# Altium schematic sheet Power.SchDoc
size A; SheetNumber: 6; SheetTotal: 7
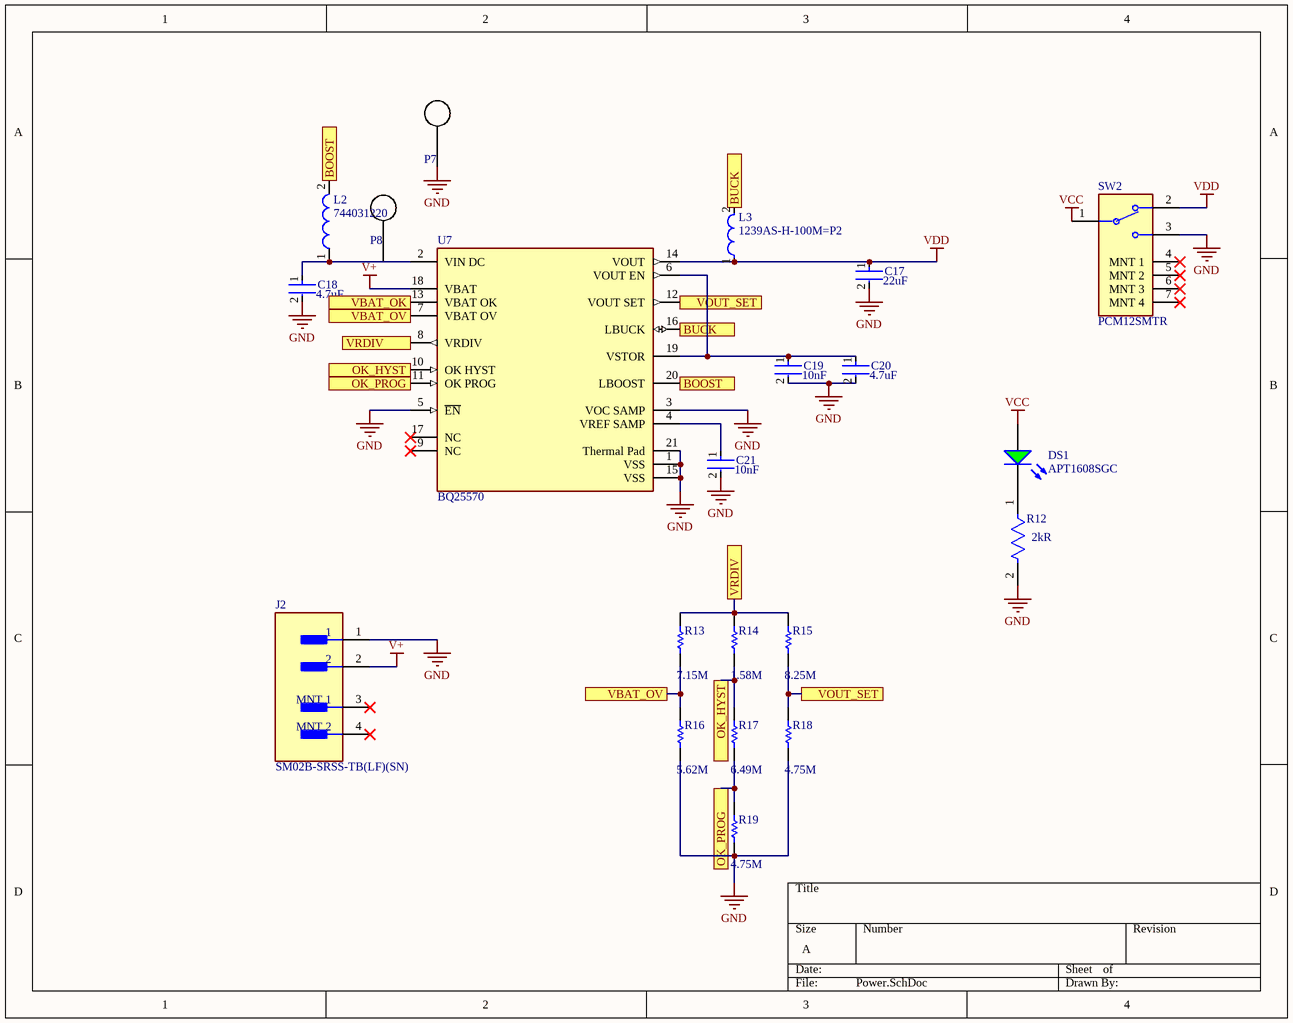
[diagram p0: Power.SchDoc]

## Parts
C17  Capacitance: 22uF  [FP-GRM21B-0_15-MFG]  (hidden comment: GRM21BR60J226ME39L)
C18  Capacitance: 4.7uF  [FP-C0603-CG-MFG]  (hidden comment: C0603C475K9PACTU)
C19  Capacitance: 10nF  [FP-C0805C-DN-MFG]  (hidden comment: C0805C103K2RACTU)
C20  Capacitance: 4.7uF  [FP-C0603-CG-MFG]  (hidden comment: C0603C475K9PACTU)
C21  Capacitance: 10nF  [FP-C0805C-DN-MFG]  (hidden comment: C0805C103K2RACTU)
DS1  APT1608SGC  [KING-APT1608SGC_V]
J2  SM02B-SRSS-TB(LF)(SN)  [FP-SM02B-SRSS-TB_LF_SN-0]
L2  744031220  [WE-TPC-3816-S]
L3  1239AS-H-100M=P2  [FP-DFE252012C-MFG]
P7  BlankPad  [BlankPad]  (value not drawn)
P8  BlankPad  [BlankPad]  (value not drawn)
R12  Resistance: 2kR  [FP-CRCW0805-e3-IPC_B]  (hidden comment: CRCW08052K00FKEA)
R13  Parameter 1: 7.15M  [RESC2013X50X30LL20T20]  (hidden comment: CRCW0805100RFKEA)
R14  Parameter 1: 1.58M  [RESC2013X50X30LL20T20]  (hidden comment: CRCW0805100RFKEA)
R15  Parameter 1: 8.25M  [RESC2013X50X30LL20T20]  (hidden comment: CRCW0805100RFKEA)
R16  Parameter 1: 5.62M  [RESC2013X50X30LL20T20]  (hidden comment: CRCW0805100RFKEA)
R17  Parameter 1: 6.49M  [RESC2013X50X30LL20T20]  (hidden comment: CRCW0805100RFKEA)
R18  Parameter 1: 4.75M  [RESC2013X50X30LL20T20]  (hidden comment: CRCW0805100RFKEA)
R19  Parameter 1: 4.75M  [RESC2013X50X30LL20T20]  (hidden comment: CRCW0805100RFKEA)
SW2  PCM12SMTR  [FP-PCM12SMTR-MFG]
U7  BQ25570  [FP-RGR0020A-MFG]

## Ports
BOOST, BUCK, OK_HYST, OK_PROG, VBAT_OK, VBAT_OV, VOUT_SET, VRDIV

## Nets
GND: C17.2 C18.2 C19.2 C20.2 C21.2 J2.1 R12.2 R16.1 R18.1 R19.1 SW2.3 U7.1(VSS) U7.3(VOC_SAMP) U7.5(~{EN}) U7.15(VSS) U7.21(Thermal_Pad)
V+: J2.2 U7.18(VBAT)
VCC: DS1.1(A) SW2.1
VDD: C17.1 L3.1 SW2.2 U7.14(VOUT)
BOOST: L2.2 U7.20(LBOOST) ; port BOOST
BUCK: L3.2 U7.16(LBUCK) ; port BUCK
OK_HYST: R14.1 R17.2 U7.10(OK_HYST) ; port OK_HYST
OK_PROG: R17.1 R19.2 U7.11(OK_PROG) ; port OK_PROG
VBAT_OK: U7.13(VBAT_OK) ; port VBAT_OK
VBAT_OV: R13.1 R16.2 U7.7(VBAT_OV) ; port VBAT_OV
VOUT_SET: R15.1 R18.2 U7.12(VOUT_SET) ; port VOUT_SET
VRDIV: R13.2 R14.2 R15.2 U7.8(VRDIV) ; port VRDIV
NetC18_1: C18.1 L2.1 U7.2(VIN_DC)
NetC19_1: C19.1 C20.1 U7.6(VOUT_EN) U7.19(VSTOR)
NetC21_1: C21.1 U7.4(VREF_SAMP)
NetDS1_2: DS1.2(K) R12.1

Not connected (* = marked no-connect by the designer): J2 3(MNT_1)* 4(MNT_2)*; P7 0; P8 0; SW2 4(MNT_1)* 5(MNT_2)* 6(MNT_3)* 7(MNT_4)*; U7 9(NC)* 17(NC)*

## Notes on the sheet
- Labels drawn without touching a wire or pin: GND

## Library data of the parts
C17 = CMP-2007-03385-2: Chip Multilayer Ceramic Capacitors for General Purpose, 0805, 22uF, X5R, 15%, 20%, 6.3V; Material: Ceramic; Max Operating Temperature: 85°C; Voltage: 6.3V; Min Operating Temperature: -55°C; Case/Package: 0805; Thickness: 0.053inch; Dielectric: X5R; Packaging: Tape and Reel; Depth: 1.25mm; Termination: SMD/SMT; Voltage Rating (DC): 6.3V; Radiation Hardening: No; Tolerance: 20%; Mount: Surface Mount; Lead Free: Lead Free; Package Quantity: 1; REACH SVHC: No SVHC; Voltage Rating: 6.3V; Length: 2mm; Case Code (Imperial): 0805; Case Code (Metric): 2012; Width: 0.049inch; Height: 1.25mm
C18 C20 = CMP-2006-02256-2: CAP CER 4.7UF 6.3V X5R 0603; Manufacturer: Kemet; Temperature Coefficient: 15%; Tolerance: 10%; Material: Ceramic; Device Class L3: Ceramic Capacitors; RoHS: TRUE; Value: 4.7uF; Lead Free: Yes; ComponentLink2Description: Datasheet; Mouser Description: Multilayer Ceramic Capacitors MLCC - SMD/SMT 6.3volts 4.7uF X5R 10%; Package: C0603-CG; Digikey Description: CAP CER 4.7UF 6.3V X5R 0603; ComponentLink2URL: https://content.kemet.com/datasheets/KEM_C1006_X5R_SMD.pdf; Category: Cap; Temperature Range Low: -55°C; Temperature: -55°C to +85°C; Octopart: https://octopart.com/c0603c475k9pactu-kemet-104242; Ipc Land Pattern Name: CAPC16080X80; Voltage Rating: 6.3V; Temperature Range High: +85°C; Height: 0.9mm; Temperature Characteristic: X5R; Device Class L1: Passive Components; Manufacturer Part Number: C0603C475K9PACTU; Automotive: No; Device Class L2: Capacitors
C19 C21 = CMP-2007-00259-2: CAP CER 10000PF 200V X7R 0805; Manufacturer: KEMET; Material: Ceramic; Temperature Coefficient: 30ppm/°C; Tolerance: 0.1; Value: 10,000 pF; Device Class L2: Capacitors; Voltage Rating: 200 V; Temperature Range High: +125°C; ComponentLink2Description: Datasheet; Height: 0.88mm; Octopart: https://octopart.com/c0805c103k2ractu-kemet-9138347; ComponentLink2URL: https://content.kemet.com/datasheets/KEM_C1003_C0G_SMD.pdf; Category: Cap; Temperature: -55°C to +125°C; Temperature Range Low: -55°C; Digikey Description: CAP CER 10000PF 200V X7R 0805; Manufacturer Part Number: C0805C103K2RACTU; Temperature Characteristic: X7R; Automotive: No; Device Class L3: Ceramic Capacitors; Mouser Description: KEMET - C0805C103K2RACTU - CAP, MLCC, X7R, 10NF, 200V, 0805; RoHS: TRUE; Device Class L1: Passive Components; Lead Free: Yes; Package: C0805C-DN; Ipc Land Pattern Name: CAPC200125X78
DS1 = CMP-2000-05789-1: Super Bright Green LED, 62.5 mW, 25 mA, -40 to 85 degC, 2-Pin SMD, RoHS, Tape and Reel; Manufacturer: Kingbright; Online Catalog: 0603RectanglewithFlatTopChipLEDs; Wavelength - Dominant: 568nm; Wavelength - Peak: 565nm; Voltage - Forward (Vf) (Typ): 2.2V; Lens Type: Clear; Other Names: 754-1121-2; Millicandela Rating: 15mcd; Catalog Drawings: APT1608SeriesTop / APT1608SeriesSide; Lens Style/Size: RectanglewithFlatTop,1.2mmx0.8mm; Current - Test: 20mA; 3D Model: APT1608x.sldprt / APT1608x.pro / APT1608x.igs / APT1608x.stp; Viewing Angle: 120°; Package / Case: 0603(1608Metric); Category: Optoelectronics; Package Description: 2-Pin Surface Mount Device, Body 0.8 x 1.6 mm; Mounting Type: SurfaceMount; Color: Green; Height: 0.75mm; Datasheet Version: Rev. 16B, 02/2012; Family: LEDIndication-Discrete; Manufacturer URL: http://www.kingbright.com/; Package Reference: APT1608SGC; Datasheet URL: https://datasheet.ciiva.com/2113/apt1608sgc-2113808.pdf; Mounting Technology: SurfaceMount; Packaging: Tape&Reel(TR); Standard Package: 2,000; Size / Dimension: 1.60mmLx0.80mmW
J2 = CMP-17439-000024-1: CONN HEADER SMD R/A 2POS 1MM; Current Rating: 700mA; Voltage Rating: 50V; Insulation Resistance: 100MR; Number of Contacts: 2; Contact Resistance: 40mR; Max Current Rating: 1A; Min Operating Temperature: -25°C; Housing Material: Polyamide; Flammability Rating: UL94 V-0; Lead Pitch: 1mm; REACH SVHC: No SVHC; Lead Free: Lead Free; Contact Finish - Mating: TIN; Packaging: Tape and Reel; Series: SR; Length: 4mm; Color: Natural; Housing Color: Beige; Number of Rows: 1; Insulation Color: Natural; Connector Type: Header; Contact Shape: Square; Depth: 4.95mm; Termination: Solder; Voltage Rating (AC): 50V; Max Operating Temperature: 85°C; Pitch: 1mm; Fastening Type: Pull; Number of Positions: 2; Contact Type: Male Pin; Material: Polyamide; Orientation: Right Angle; Mount: Surface Mount; Insulation Material: Nylon; Contact Plating: Copper; Max Voltage Rating (AC): 50V; Contact Material: Copper Alloy
L2 = CMP-0227-00346-1: SMD Shielded Tiny Power Inductor WE-TPC, L = 22.0 µH; Inductance: 22.0 ÂµH; ComponentLink1URL: http://www.we-online.com; PackageReference: WE-TPC-3816-S; ComponentLink1Description: Manufacturer Link; PackageVersion: 2009; ComponentLink2URL: http://www.we-online.de/katalog/media/pdf/744031220.pdf; PackageDescription: SMD Inductor, 2-Leads, Body 3.8 x 3.8 mm; ComponentLink2Description: Datasheet; DatasheetVersion: ver 6, Jan-2009
L3 = CMP-06042-012626-1: FIXED IND 10UH 1A 460 MOHM SMD; Shielding: Shielded; Core Material: Ferrite; DC Resistance (DCR): 460mR; Max DC Current: 850mA; Test Frequency: 1MHz; Tolerance: 20%; Mount: Surface Mount; Length: 0.098inch; Current Rating: 1A; Resistor Type: Wirewound; Packaging: Tape and Reel; Min Operating Temperature: -40°C; Width: 0.079inch; Max Operating Temperature: 85°C; Inductance: 10uH; Case Code (Metric): 2520; Depth: 2mm; Height - Seated (Max): 0.047inch; Case Code (Imperial): 1008; Case/Package: 1008
R12 = CMP-2001-03755-2: RES Thick Film, 2kΩ, 1%, 0.125W, 100ppm/°C, 0805; Working Voltage: 150V; Max Power Dissipation: 125mW; Package Quantity: 10; Case Code (Metric): 2012; Voltage Rating: 150V; Number of Terminations: 2; Max Operating Temperature: 155°C; Depth: 1.25mm; Tolerance: 1%; Power Rating: 125mW; Lead Free: Lead Free; Case/Package: 0805; Features: Automotive AEC-Q200; Min Operating Temperature: -55°C; Termination: SMD/SMT; Case Code (Imperial): 0805; Weight: 0.000194oz; Packaging: Tape and Reel; Military Standard: Not; Radiation Hardening: No; Contact Plating: Tin; Mount: Surface Mount; Temperature Coefficient: 100ppm/°C; Height: 0.02inch; Number of Terminals: 2; Voltage Rating (DC): 150V; Number of Pins: 2; Length: 2mm; Width: 1.25mm; Composition: Thick Film
R13-R19 = CMP-2001-04901-1: Manufacturer: Vishay Dale; Part Number: CRCW0805100RFKEA
SW2 = CMP-2000-06884-2: SWITCH SLIDE SPDT 300MA 6V; Actuator Material: Nylon; Switch Function: On-On; Insulation Resistance: 100mR; Actuator Type: Standard; Mechanical Life: 10000Cycles; Actuator Length: 1.5mm; Contact Resistance: 70mR; Min Operating Temperature: -20°C; Max Current Rating: 300mA; Max Voltage Rating (DC): 6V; Package Quantity: 1; Mount: Surface Mount; Packaging: Tape and Reel; Contact Plating: Silver; Depth: 5mm; REACH SVHC: No SVHC; Voltage Rating (DC): 6V; Voltage Rating (AC): 6V; Max Operating Temperature: 85°C; Length: 7.7mm; Termination: Gull Wing; Current Rating: 300mA; Contact Current Rating: 300mA; Orientation: Right Angle; Width: 6.7mm; Switch Travel: 1.5mm; Lead Free: Lead Free; Contact Material: Copper Alloy; Throw Configuration: SPDT
U7 = CMP-04911-000040-1: IC ENERGY HARV CTRLR BATT 20VQFN; Operating Supply Current: 488nA; Switching Frequency: 1MHz; Operating Supply Voltage: 4V; Output Current: 100mA; Packaging: Tape and Reel; Lead Free: Lead Free; Contact Plating: Gold; RoHS Compliant: Yes; Mount: Surface Mount; Case/Package: VQFN; Min Operating Temperature: -40°C; Max Operating Temperature: 125°C; Package Quantity: 3000; Number of Pins: 20